# EAGLE design SenseBorgHAT (EAGLE 9.6.0)
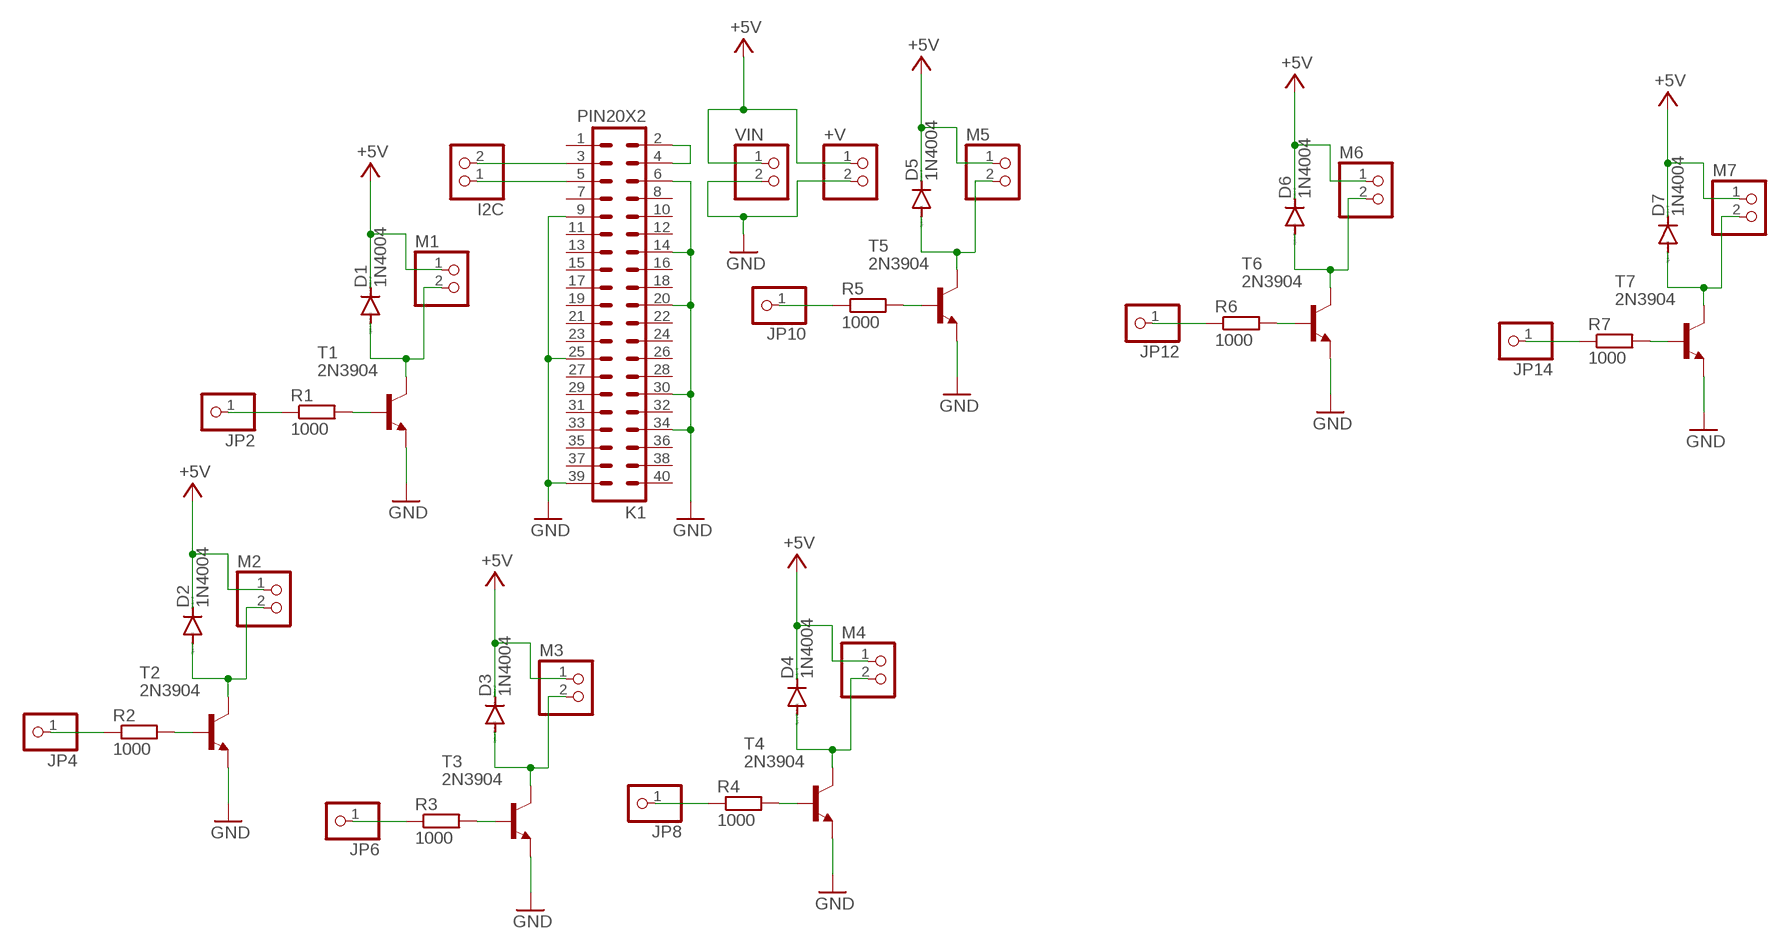
[diagram p0: schematic, sheet 1, part 1 of 2]
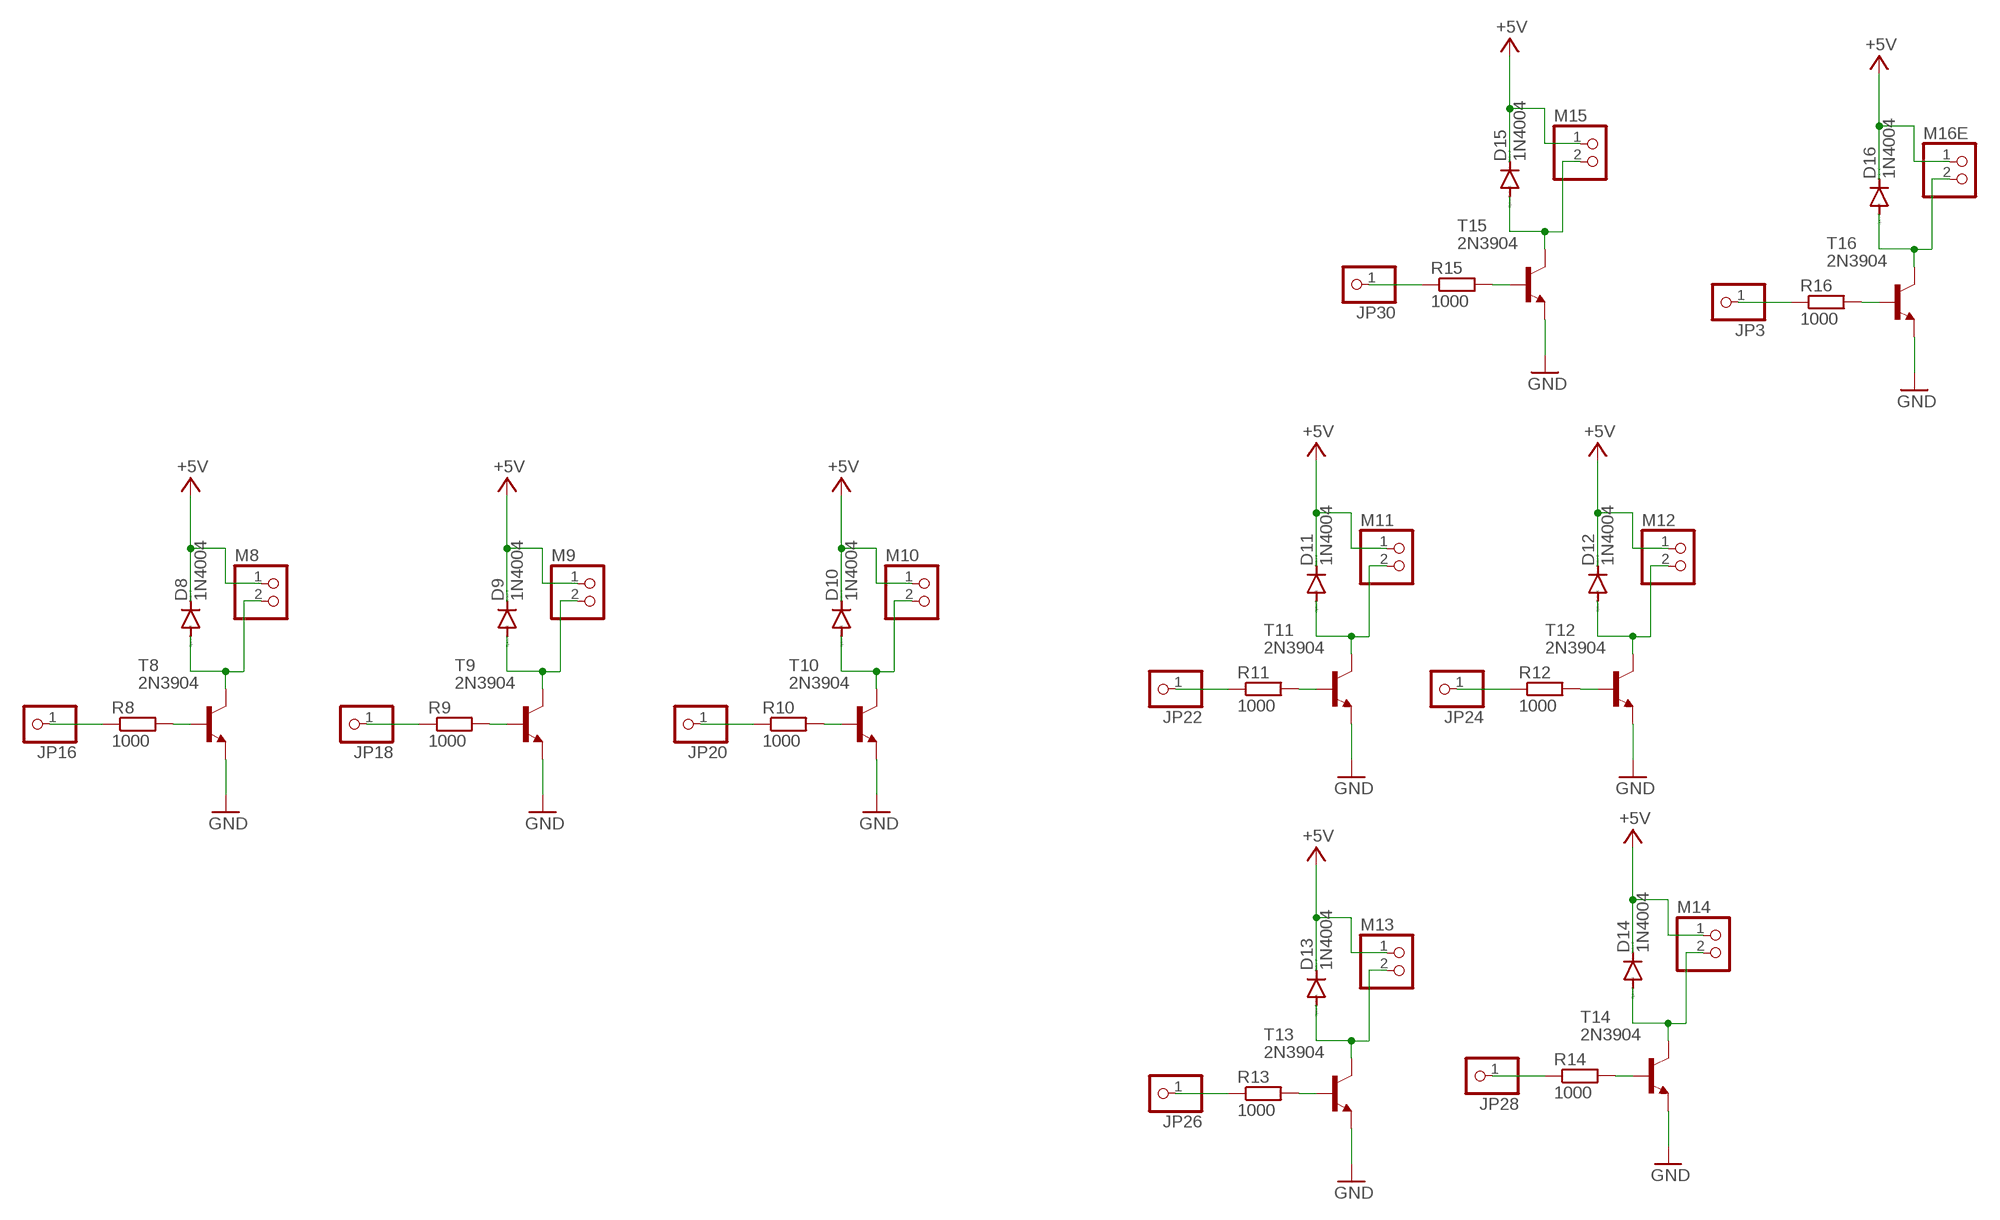
[diagram p1: schematic, sheet 1, part 2 of 2]

## Parts
+V  PINHD-1X2  [1X02]
D1  1N4004  [DO41-10]
D2  1N4004  [DO41-10]
D3  1N4004  [DO41-10]
D4  1N4004  [DO41-10]
D5  1N4004  [DO41-10]
D6  1N4004  [DO41-10]
D7  1N4004  [DO41-10]
D8  1N4004  [DO41-10]
D9  1N4004  [DO41-10]
D10  1N4004  [DO41-10]
D11  1N4004  [DO41-10]
D12  1N4004  [DO41-10]
D13  1N4004  [DO41-10]
D14  1N4004  [DO41-10]
D15  1N4004  [DO41-10]
D16  1N4004  [DO41-10]
I2C  PINHD-1X2  [1X02]
JP2  PINHD-1X1  [1X01]
JP3  PINHD-1X1  [1X01]
JP4  PINHD-1X1  [1X01]
JP6  PINHD-1X1  [1X01]
JP8  PINHD-1X1  [1X01]
JP10  PINHD-1X1  [1X01]
JP12  PINHD-1X1  [1X01]
JP14  PINHD-1X1  [1X01]
JP16  PINHD-1X1  [1X01]
JP18  PINHD-1X1  [1X01]
JP20  PINHD-1X1  [1X01]
JP22  PINHD-1X1  [1X01]
JP24  PINHD-1X1  [1X01]
JP26  PINHD-1X1  [1X01]
JP28  PINHD-1X1  [1X01]
JP30  PINHD-1X1  [1X01]
K1  PIN20X2  [PIN_20X2]
M1  PINHD-1X2  [1X02]
M2  PINHD-1X2  [1X02]
M3  PINHD-1X2  [1X02]
M4  PINHD-1X2  [1X02]
M5  PINHD-1X2  [1X02]
M6  PINHD-1X2  [1X02]
M7  PINHD-1X2  [1X02]
M8  PINHD-1X2  [1X02]
M9  PINHD-1X2  [1X02]
M10  PINHD-1X2  [1X02]
M11  PINHD-1X2  [1X02]
M12  PINHD-1X2  [1X02]
M13  PINHD-1X2  [1X02]
M14  PINHD-1X2  [1X02]
M15  PINHD-1X2  [1X02]
M16E  PINHD-1X2  [1X02]
R1  1000  R-EU_0207/10  [0207/10]
R2  1000  R-EU_0207/10  [0207/10]
R3  1000  R-EU_0207/10  [0207/10]
R4  1000  R-EU_0207/10  [0207/10]
R5  1000  R-EU_0207/10  [0207/10]
R6  1000  R-EU_0207/10  [0207/10]
R7  1000  R-EU_0207/10  [0207/10]
R8  1000  R-EU_0207/10  [0207/10]
R9  1000  R-EU_0207/10  [0207/10]
R10  1000  R-EU_0207/10  [0207/10]
R11  1000  R-EU_0207/10  [0207/10]
R12  1000  R-EU_0207/10  [0207/10]
R13  1000  R-EU_0207/10  [0207/10]
R14  1000  R-EU_0207/10  [0207/10]
R15  1000  R-EU_0207/10  [0207/10]
R16  1000  R-EU_0207/10  [0207/10]
T1  2N3904  [TO92]
T2  2N3904  [TO92]
T3  2N3904  [TO92]
T4  2N3904  [TO92]
T5  2N3904  [TO92]
T6  2N3904  [TO92]
T7  2N3904  [TO92]
T8  2N3904  [TO92]
T9  2N3904  [TO92]
T10  2N3904  [TO92]
T11  2N3904  [TO92]
T12  2N3904  [TO92]
T13  2N3904  [TO92]
T14  2N3904  [TO92]
T15  2N3904  [TO92]
T16  2N3904  [TO92]
VIN  PINHD-1X2  [1X02]

## Nets
+5V: +V.1 D1.C D2.C D3.C D4.C D5.C D6.C D7.C D8.C D9.C D10.C D11.C D12.C D13.C D14.C D15.C D16.C M1.1 M2.1 M3.1 M4.1 M5.1 M6.1 M7.1 M8.1 M9.1 M10.1 M11.1 M12.1 M13.1 M14.1 M15.1 M16E.1 VIN.1
+5V1: I2C.1 K1.5
GND: +V.2 K1.6 K1.9 K1.14 K1.20 K1.25 K1.30 K1.34 K1.39 T1.3(E) T2.3(E) T3.3(E) T4.3(E) T5.3(E) T6.3(E) T7.3(E) T8.3(E) T9.3(E) T10.3(E) T11.3(E) T12.3(E) T13.3(E) T14.3(E) T15.3(E) T16.3(E) VIN.2
M15: D10.A M10.2 T10.1(C)
N$1: R1.2 T1.2(B)
N$2: D1.A M1.2 T1.1(C)
N$3: JP2.1 R1.1
N$4: R2.2 T2.2(B)
N$5: D2.A M2.2 T2.1(C)
N$6: JP4.1 R2.1
N$7: R3.2 T3.2(B)
N$8: D3.A M3.2 T3.1(C)
N$9: JP6.1 R3.1
N$10: R4.2 T4.2(B)
N$11: D4.A M4.2 T4.1(C)
N$12: JP8.1 R4.1
N$13: R5.2 T5.2(B)
N$14: D5.A M5.2 T5.1(C)
N$15: JP10.1 R5.1
N$16: R6.2 T6.2(B)
N$17: D6.A M6.2 T6.1(C)
N$18: JP12.1 R6.1
N$19: R7.2 T7.2(B)
N$20: D7.A M7.2 T7.1(C)
N$21: JP14.1 R7.1
N$22: R8.2 T8.2(B)
N$23: D8.A M8.2 T8.1(C)
N$24: JP16.1 R8.1
N$25: R9.2 T9.2(B)
N$26: D9.A M9.2 T9.1(C)
N$27: JP18.1 R9.1
N$28: R10.2 T10.2(B)
N$29: R16.2 T16.2(B)
N$30: JP20.1 R10.1
N$31: R11.2 T11.2(B)
N$32: D11.A M11.2 T11.1(C)
N$33: JP22.1 R11.1
N$34: R12.2 T12.2(B)
N$35: D12.A M12.2 T12.1(C)
N$36: JP24.1 R12.1
N$37: R13.2 T13.2(B)
N$38: D13.A M13.2 T13.1(C)
N$39: JP26.1 R13.1
N$40: R14.2 T14.2(B)
N$41: D14.A M14.2 T14.1(C)
N$42: JP28.1 R14.1
N$43: R15.2 T15.2(B)
N$44: D15.A M15.2 T15.1(C)
N$45: JP30.1 R15.1
N$46: D16.A M16E.2 T16.1(C)
N$47: JP3.1 R16.1
N$48: I2C.2 K1.3
N$50: K1.2 K1.4
Unconnected: K1.1 K1.7 K1.8 K1.10 K1.11 K1.12 K1.13 K1.15 K1.16 K1.17 K1.18 K1.19 K1.21 K1.22 K1.23 K1.24 K1.26 K1.27 K1.28 K1.29 K1.31 K1.32 K1.33 K1.35 K1.36 K1.37 K1.38 K1.40

## Library data of the parts
+V I2C M1-M15 M16E VIN = pinhead:PINHD-1X2: PIN HEADER
D1-D16 = diode:1N4004: DIODE general purpose rectifier, 1 A
JP2-JP4 JP6 JP8 JP10 JP12 JP14 JP16 JP18 JP20 JP22 JP24 JP26 JP28 JP30 = pinhead:PINHD-1X1: PIN HEADER
K1 = FLYFISH:PIN20X2
R1-R16 = rcl:R-EU_: RESISTOR, European symbol; SPICEPREFIX: R
T1-T16 = transistor:2N3904: NPN TRANSISTOR

## Net classes
0 default: width 0.305 mm, drill 0.508 mm, clearance 0.254 mm

## Board
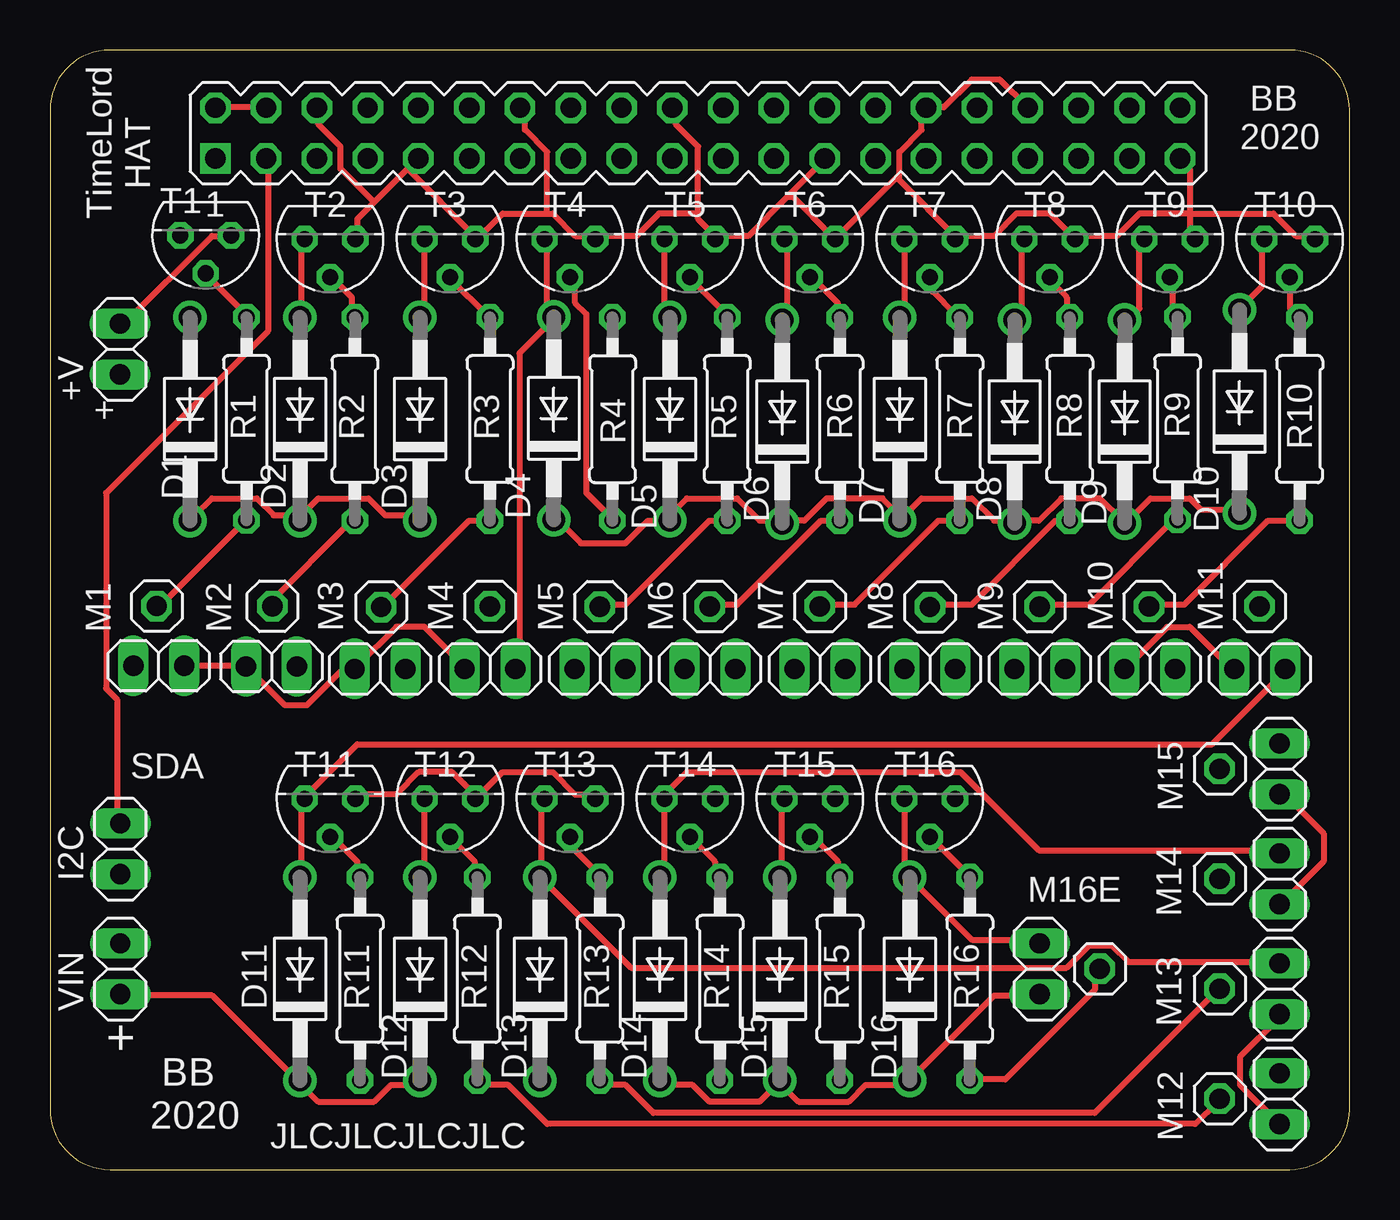
[diagram p2: board, top side]
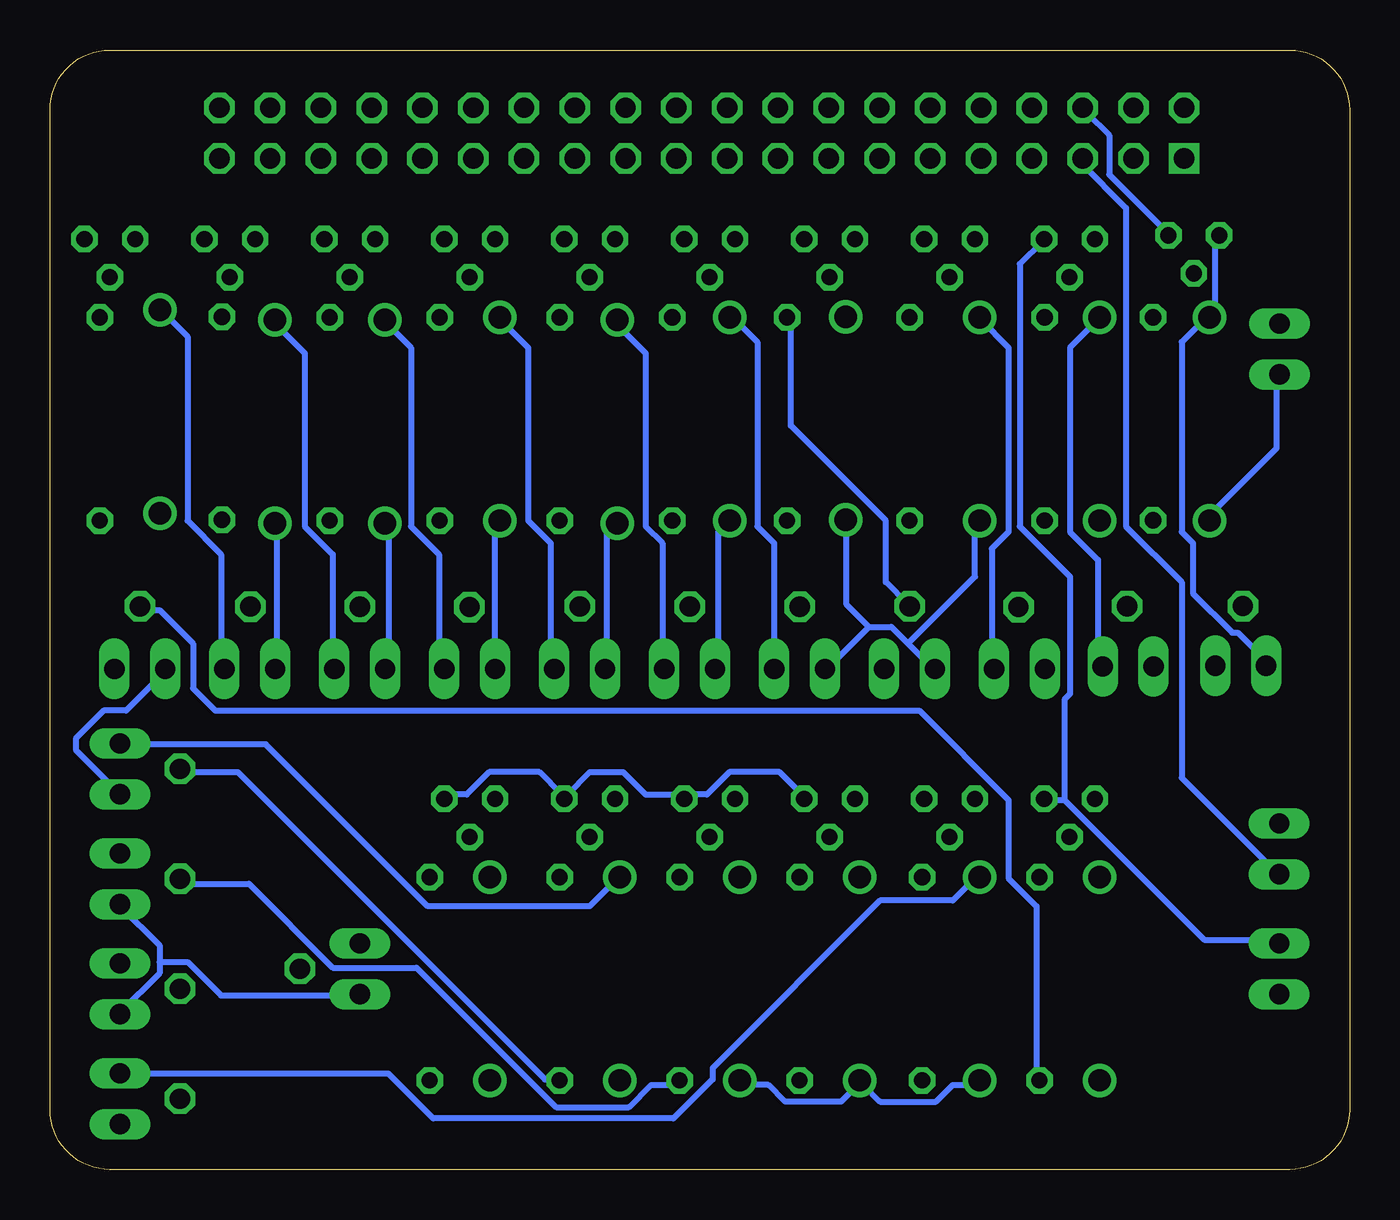
[diagram p3: board, bottom side, seen from below]

Size 65 x 56 mm. Coordinates in mm from the lower left corner, seen from the top.
Outline: 0,3 arc90 3,0 62,0 arc90 65,3 65,53 arc90 62,56 3,56 arc90 0,53 0,3
Copper layers (1*16): Top 0.035mm / dielectric 1.5mm / Bottom 0.035mm
Design rules "default": minimum track width 6mil, minimum drill 0.35mm, track to track 6mil, track to pad 6mil, pad to pad 6mil, via to via 6mil, smd to smd 6mil, copper to edge 40mil, drill to drill 6mil, minimum pad ring 10mil, minimum via ring 8mil, stop-mask expansion 4mil, vias tented up to drill 0mil, thermal gap 10mil

### Footprints (pad centres in the part's own frame; a part is rotated, then mirrored left to right if it is on the bottom)
1X02 = drill 1.016 long: 1 -1.27,0; 2 1.27,0
DO41-10 = drill 1.118: A 5.08,0; C -5.08,0
1X01 = drill 1.016 octagon: 1 0,0
PIN_20X2 = drill 1.016 square: 1 -24.13,-1.27 | drill 1.016 octagon: 2 -24.13,1.27; 3 -21.59,-1.27; 4 -21.59,1.27; 5 -19.05,-1.27; 6 -19.05,1.27; 7 -16.51,-1.27; 8 -16.51,1.27; 9 -13.97,-1.27; 10 -13.97,1.27; 11 -11.43,-1.27; 12 -11.43,1.27; 13 -8.89,-1.27; 14 -8.89,1.27; 15 -6.35,-1.27; 16 -6.35,1.27; 17 -3.81,-1.27; 18 -3.81,1.27; 19 -1.27,-1.27; 20 -1.27,1.27; 21 1.27,-1.27; 22 1.27,1.27; 23 3.81,-1.27; 24 3.81,1.27; 25 6.35,-1.27; 26 6.35,1.27; 27 8.89,-1.27; 28 8.89,1.27; 29 11.43,-1.27; 30 11.43,1.27; 31 13.97,-1.27; 32 13.97,1.27; 33 16.51,-1.27; 34 16.51,1.27; 35 19.05,-1.27; 36 19.05,1.27; 37 21.59,-1.27; 38 21.59,1.27; 39 24.13,-1.27; 40 24.13,1.27
0207/10 = drill 0.813 octagon: 1 -5.08,0; 2 5.08,0
TO92 = drill 0.813 octagon: 1 1.27,0; 2 0,1.905; 3 -1.27,0

### Placement (x,y rotation side)
+V  3.51,41.04 90 top
D1  7.01,37.54 90 top
D2  12.51,37.54 90 top
D3  18.51,37.54 90 top
D4  25.2,37.57 90 top
D5  31.01,37.54 90 top
D6  36.63,37.41 90 top
D7  42.51,37.54 90 top
D8  48.25,37.41 90 top
D9  53.75,37.41 90 top
D10  59.5,37.91 90 top
D11  12.51,9.54 90 top
D12  18.51,9.54 90 top
D13  24.51,9.54 90 top
D14  30.51,9.54 90 top
D15  36.51,9.54 90 top
D16  43.01,9.54 90 top
I2C  3.52,16.04 90 top
JP2  5.34,28.18 0 top
JP3  52.51,10.04 0 top
JP4  11.12,28.18 0 top
JP6  16.56,28.13 0 top
JP8  22.01,28.17 0 top
JP10  27.51,28.15 0 top
JP12  33.01,28.16 0 top
JP14  38.51,28.17 0 top
JP16  44.02,28.13 0 top
JP18  49.5,28.15 0 top
JP20  54.98,28.16 0 top
JP22  60.51,28.17 0 top
JP24  58.51,3.54 0 top
JP26  58.51,9.04 0 top
JP28  58.51,14.54 0 top
JP30  58.51,20.04 0 top
K1  32.4,51.84 0 top
M1  5.44,25.2 180 top
M2  11.08,25.16 0 top
M3  16.51,25.04 0 top
M4  22.01,25.04 0 top
M5  27.51,25.04 0 top
M6  33.01,25.04 0 top
M7  38.51,25.04 0 top
M8  44.01,25.04 0 top
M9  49.51,25.04 0 top
M10  55.01,25.04 0 top
M11  60.51,25.04 0 top
M12  61.51,3.54 90 top
M13  61.51,9.04 90 top
M14  61.51,14.54 90 top
M15  61.51,20.04 90 top
M16E  49.51,10.04 90 top
R1  9.83,37.55 90 top
R2  15.25,37.54 90 top
R3  22.01,37.54 90 top
R4  28.13,37.54 270 top
R5  33.87,37.54 90 top
R6  39.51,37.54 90 top
R7  45.51,37.54 90 top
R8  51.01,37.54 90 top
R9  56.4,37.57 90 top
R10  62.51,37.54 90 top
R11  15.51,9.54 90 top
R12  21.38,9.54 90 top
R13  27.51,9.54 90 top
R14  33.51,9.54 90 top
R15  39.51,9.54 90 top
R16  46.01,9.54 90 top
T1  7.79,46.73 180 top
T2  14.01,46.54 180 top
T3  20.01,46.54 180 top
T4  26.01,46.54 180 top
T5  32.01,46.54 180 top
T6  38.01,46.54 180 top
T7  44.01,46.54 180 top
T8  50.01,46.54 180 top
T9  56.01,46.54 180 top
T10  62.01,46.54 180 top
T11  14.01,18.54 180 top
T12  20.01,18.54 180 top
T13  26.01,18.54 180 top
T14  32.01,18.54 180 top
T15  38.01,18.54 180 top
T16  44.01,18.54 180 top
VIN  3.52,10.04 90 top

### Tracks (layer width: path | path; a pad name or v marks a point on that pad's centre or on a via)
+5V
  Top 0.305: M16E.1 49.46,8.7 47.23,8.7 43.03,4.51 D16.C 42.75,4.23 40.8,4.23 39.96,3.39 37.45,3.39 36.61,4.23 D15.C 36.33,4.23 35.49,3.39 32.98,3.39 32.14,4.23 30.74,4.23 D14.C | VIN.1 3.64,8.7 8.11,8.7 12.3,4.51 D11.C 12.58,4.23 13.42,3.39 16.21,3.39 17.05,4.23 18.45,4.23 D12.C | D1.C 7.27,32.73 8.11,33.57 10.34,33.57 11.18,32.73 12.3,32.73 D2.C 12.58,32.73 13.42,33.57 15.93,33.57 16.77,32.73 18.45,32.73 D3.C | M1.1 6.71,25.19 9.79,25.19 M2.1 10.06,24.91 11.74,23.23 12.86,23.23 14.54,24.91 15.09,24.91 M3.1 15.37,25.19 17.33,27.14 18.73,27.14 20.68,25.19 M4.1 | D4.C 25.43,32.45 26.55,31.33 28.79,31.33 29.9,32.45 30.74,32.45 D5.C 31.02,32.73 31.86,33.57 34.37,33.57 35.49,32.45 36.61,32.45 D6.C 36.89,32.45 37.73,32.45 38.84,33.57 41.64,33.57 42.48,32.73 D7.C 42.75,32.73 43.59,33.57 46.11,33.57 47.23,32.45 48.06,32.45 D8.C 48.34,32.45 49.46,32.45 50.58,33.57 52.53,33.57 53.65,32.45 D9.C 53.93,32.45 55.05,33.57 57,33.57 57.56,33.01 59.24,33.01 D10.C | M12.1 61.48,2.27 59.52,4.23 59.52,5.63 61.48,7.58 M13.1 | M14.1 61.75,13.45 63.71,15.41 63.71,16.8 61.75,18.76 M15.1 | M11.1 58.96,25.19 57,27.14 55.89,27.14 53.93,25.19 M10.1
  Bottom 0.305: D12.C 18.73,4.23 19.84,4.23 20.68,3.39 23.48,3.39 24.32,4.23 D13.C 24.59,4.23 25.43,3.39 28.23,3.39 29.07,4.23 30.46,4.23 D14.C | +V.1 3.64,39.71 3.64,36.08 6.99,32.73 D1.C | M7.1 37.17,25.19 37.17,31.89 36.89,32.17 D6.C | M6.1 31.58,25.19 31.58,31.89 31.02,32.45 D5.C | 22.08,26.3 22.92,27.14 24.04,27.14 | 22.08,26.3 20.96,25.19 M4.1 | 24.04,27.14 25.99,25.19 M5.1 | 24.04,27.14 25.15,28.26 25.15,32.45 D4.C | 22.08,26.3 18.73,29.66 18.73,32.45 D3.C | 59.52,10.38 59.52,11.22 61.48,13.17 M14.1 | 59.52,10.38 59.52,9.82 61.48,7.86 M13.1 | M9.1 48.06,25.19 48.06,32.17 D8.C | M8.1 42.75,25.19 42.75,32.45 D7.C | M10.1 53.65,25.19 53.65,32.17 D9.C | M15.1 61.75,19.04 63.71,20.99 63.71,21.55 62.31,22.95 61.2,22.95 59.24,24.91 M11.1 | 59.52,10.38 58.12,10.38 56.45,8.7 49.74,8.7 M16E.1
+5V1
  Bottom 0.305: I2C.1 3.64,14.85 8.39,19.6 8.39,29.38 11.18,32.17 11.18,48.1 13.42,50.33 K1.5
GND
  Top 0.305: T11.3 15.37,18.76 17.33,18.76 18.45,19.88 20.12,19.88 21.24,18.76 T12.3 21.52,18.76 22.64,19.88 25.15,19.88 26.27,18.76 27.11,18.76 T13.3 | T1.3 8.95,46.7 8.11,46.7 3.64,42.23 +V.2 | 17.89,50.05 18.17,50.33 K1.9 17.89,50.05 | 17.89,50.05 16.21,48.38 | 16.21,48.38 15.37,47.54 15.37,46.7 T2.3 | 17.89,50.05 21.24,46.7 T3.3 21.52,46.7 22.64,47.82 24.87,47.82 | 24.87,47.82 25.15,47.82 26.27,46.7 27.11,46.7 T4.3 27.39,46.7 29.34,46.7 30.46,47.82 32.42,47.82 | 16.21,48.38 14.54,50.05 14.54,51.17 13.42,52.29 13.42,52.85 K1.6 | 24.87,47.82 24.87,50.89 23.76,52.01 23.76,52.85 K1.14 | 36.89,48.66 38.56,50.33 K1.25 | 36.89,48.66 34.93,46.7 33.53,46.7 T5.3 33.26,46.7 32.42,47.54 32.42,47.82 | 36.89,48.66 37.17,48.66 39.12,46.7 T6.3 39.4,46.7 42.48,49.77 | 32.42,47.82 32.42,51.17 31.3,52.29 31.3,52.85 K1.20 | K1.34 48.9,53.13 47.5,54.52 46.11,54.52 44.71,53.13 43.87,53.13 K1.30 43.59,52.85 43.59,52.01 42.48,50.89 42.48,49.77 | 57,47.82 57,50.05 56.73,50.33 K1.39 | 57,47.82 57,46.7 T9.3 | 57,47.82 61.2,47.82 62.31,46.7 63.15,46.7 T10.3 | 57,47.82 54.49,47.82 53.37,46.7 51.42,46.7 T8.3 51.14,46.7 50.02,47.82 48.34,47.82 47.23,46.7 45.55,46.7 T7.3 45.27,46.7 42.48,49.49 42.48,49.77
  Bottom 0.305: T16.3 45.27,18.76 44.15,18.76 43.03,19.88 40.52,19.88 39.4,18.76 T15.3 39.12,18.76 38,19.88 36.33,19.88 35.21,18.76 33.53,18.76 T14.3 33.26,18.76 32.14,18.76 31.02,19.88 28.51,19.88 27.39,18.76 T13.3 | 14.26,18.48 7.27,11.49 3.64,11.49 VIN.2 | 14.26,18.48 15.09,18.48 T11.3 | T1.3 9.23,46.98 12.02,49.77 12.02,51.73 13.14,52.85 K1.6 | 14.26,18.48 14.26,23.51 13.98,23.79 13.98,29.66 16.49,32.17 16.49,45.3 15.37,46.42 T2.3
M15
  Top 0.305: T10.1 60.64,46.42 60.64,44.19 59.52,43.07 D10.A
  Bottom 0.305: M10.2 56.45,25.19 56.45,30.77 58.12,32.45 58.12,41.67 59.24,42.79 D10.A
N$1
  Top 0.305: T1.2 7.83,44.74 9.79,42.79 R1.2
N$2
  Bottom 0.305: T1.1 6.71,46.7 6.71,43.07 6.99,42.79 D1.A 7.27,42.51 8.39,41.39 8.39,31.89 7.83,31.33 7.83,28.82 5.87,26.86 5.59,26.86 4.2,25.46 M1.2
N$3
  Top 0.305: R1.1 9.79,32.45 5.59,28.26 JP2.1
N$4
  Top 0.305: R2.2 15.09,42.79 15.09,43.63 14.26,44.46 T2.2
N$5
  Top 0.305: T2.1 12.58,46.42 12.58,42.79 D2.A
  Bottom 0.305: M2.2 12.58,25.19 12.58,30.49 13.98,31.89 13.98,41.11 12.58,42.51 D2.A
N$6
  Top 0.305: R2.1 15.09,32.45 10.9,28.26 JP4.1
N$7
  Top 0.305: R3.2 21.8,42.79 20.12,44.46 T3.2
N$8
  Top 0.305: T3.1 18.73,46.42 18.73,42.79 D3.A
  Bottom 0.305: M3.2 17.89,25.19 17.89,31.05 17.05,31.89 17.05,41.11 18.45,42.51 D3.A
N$9
  Top 0.305: R3.1 21.8,32.45 20.96,32.45 16.77,28.26 JP6.1
N$10
  Top 0.305: T4.2 26.27,44.46 26.27,43.35 26.83,42.79 26.83,33.85 27.95,32.73 R4.2
N$11
  Top 0.305: T4.1 24.87,46.42 24.87,43.07 25.15,42.79 D4.A 25.15,42.51 23.48,40.83 23.48,25.19 M4.2
N$12
  Bottom 0.305: R4.1 27.95,42.51 27.95,37.2 23.2,32.45 23.2,29.38 22.08,28.26 JP8.1
N$13
  Top 0.305: R5.2 33.81,42.79 32.14,44.46 T5.2
N$14
  Top 0.305: T5.1 30.74,46.42 30.74,42.79 D5.A
  Bottom 0.305: M5.2 28.79,25.19 28.79,31.33 29.62,32.17 29.62,41.39 30.74,42.51 D5.A
N$15
  Top 0.305: R5.1 33.81,32.45 32.98,32.45 28.79,28.26 27.67,28.26 JP10.1
N$16
  Top 0.305: R6.2 39.4,42.79 39.4,43.35 38.28,44.46 T6.2
N$17
  Top 0.305: T6.1 36.89,46.42 36.89,42.51 D6.A
  Bottom 0.305: M6.2 34.37,25.19 34.37,31.33 35.21,32.17 35.21,40.83 36.61,42.23 D6.A
N$18
  Top 0.305: R6.1 39.4,32.45 38.56,32.45 34.37,28.26 33.26,28.26 JP12.1
N$19
  Top 0.305: T7.2 44.15,44.46 44.15,43.91 45.27,42.79 R7.2
N$20
  Top 0.305: T7.1 42.75,46.42 42.75,42.79 D7.A
  Bottom 0.305: M7.2 39.96,25.19 39.96,31.33 41.08,32.45 41.08,41.11 42.48,42.51 D7.A
N$21
  Top 0.305: R7.1 45.27,32.45 44.43,32.45 40.24,28.26 38.56,28.26 JP14.1
N$22
  Top 0.305: R8.2 50.86,42.79 50.86,43.63 50.02,44.46 T8.2
N$23
  Top 0.305: T8.1 48.62,46.42 48.62,42.79 48.34,42.51 D8.A
  Bottom 0.305: M8.2 45.55,25.19 45.55,30.77 46.95,32.17 46.95,41.11 48.06,42.23 D8.A
N$24
  Top 0.305: R8.1 50.86,32.45 50.3,32.45 46.11,28.26 44.15,28.26 JP16.1
N$25
  Top 0.305: T9.2 56.17,44.46 56.17,42.79 R9.2
N$26
  Top 0.305: T9.1 54.49,46.42 54.49,43.07 53.93,42.51 D9.A
  Bottom 0.305: M9.2 50.86,25.19 50.86,30.77 52.25,32.17 52.25,40.83 53.65,42.23 D9.A
N$27
  Top 0.305: R9.1 56.17,32.45 51.98,28.26 49.74,28.26 JP18.1
N$28
  Top 0.305: T10.2 62.03,44.46 62.03,43.07 62.31,42.79 R10.2
N$29
  Top 0.305: R16.2 45.83,14.85 44.15,16.52 T16.2
N$30
  Top 0.305: R10.1 62.31,32.45 60.92,32.45 56.73,28.26 55.05,28.26 JP20.1
N$31
  Top 0.305: R11.2 15.37,14.85 15.37,15.41 14.26,16.52 T11.2
N$32
  Top 0.305: D11.A 12.58,14.85 12.58,18.48 T11.1 12.86,18.76 15.37,21.27 58.12,21.27 61.75,24.91 M11.2
N$33
  Bottom 0.305: R11.1 15.65,4.51 15.65,13.17 17.05,14.57 17.05,18.48 21.52,22.95 56.73,22.95 57.84,24.07 57.84,26.3 59.52,27.98 60.36,27.98 JP22.1
N$34
  Top 0.305: R12.2 21.24,14.85 21.24,15.41 20.12,16.52 T12.2
N$35
  Top 0.305: T12.1 18.73,18.48 18.73,14.85 D12.A
  Bottom 0.305: M12.2 61.48,4.79 48.06,4.79 45.83,2.56 33.81,2.56 31.86,4.51 31.86,5.07 23.48,13.45 19.84,13.45 18.73,14.57 D12.A
N$36
  Top 0.305: R12.1 21.52,4.23 22.92,4.23 24.87,2.27 57.28,2.27 58.4,3.39 JP24.1
N$37
  Top 0.305: T13.2 26.27,16.52 26.27,15.97 27.39,14.85 R13.2
N$38
  Top 0.305: T13.1 24.59,18.48 24.59,14.85 D13.A 24.59,14.57 29.07,10.1 50.86,10.1 51.98,11.22 53.09,11.22 53.93,10.38 61.48,10.38 M13.2
N$39
  Top 0.305: R13.1 27.67,4.23 28.79,4.23 30.18,2.83 52.25,2.83 58.4,8.98 JP26.1
N$40
  Top 0.305: R14.2 33.26,14.85 33.26,15.41 32.14,16.52 T14.2
N$41
  Top 0.305: D14.A 30.74,14.85 30.74,18.48 T14.1 30.74,18.76 31.86,19.88 45.55,19.88 49.46,15.97 61.48,15.97 M14.2
N$42
  Bottom 0.305: R14.1 33.53,4.23 34.93,4.23 36.05,3.11 39.68,3.11 46.67,10.1 50.86,10.1 55.05,14.29 58.4,14.29 JP28.1
N$43
  Top 0.305: R15.2 39.4,14.85 39.4,15.41 38.28,16.52 T15.2
N$44
  Top 0.305: T15.1 36.61,18.48 36.61,14.85 D15.A
  Bottom 0.305: M15.2 61.48,21.27 54.21,21.27 46.11,13.17 38,13.17 36.61,14.57 D15.A
N$45
  Bottom 0.305: R15.1 39.68,4.51 40.24,4.51 55.61,19.88 58.4,19.88 JP30.1
N$46
  Top 0.305: T16.1 42.75,18.48 42.75,14.85 D16.A 43.03,14.57 46.11,11.49 49.46,11.49 M16E.2
N$47
  Top 0.305: R16.1 46.11,4.51 47.78,4.51 52.25,8.98 52.25,9.82 JP3.1
N$48
  Top 0.305: I2C.2 3.36,17.36 3.36,23.51 2.8,24.07 2.8,33.85 10.9,41.95 10.9,50.33 K1.3
N$50
  Top 0.305: K1.2 8.39,53.13 10.62,53.13 K1.4

### Text on the board
tPlace: BB / 2020 | TimeLord / HAT | + | SDA | + | BB / 2020 | JLCJLCJLCJLC